# EAGLE design MiMo-Button-V2.0 (EAGLE 8.7.0)
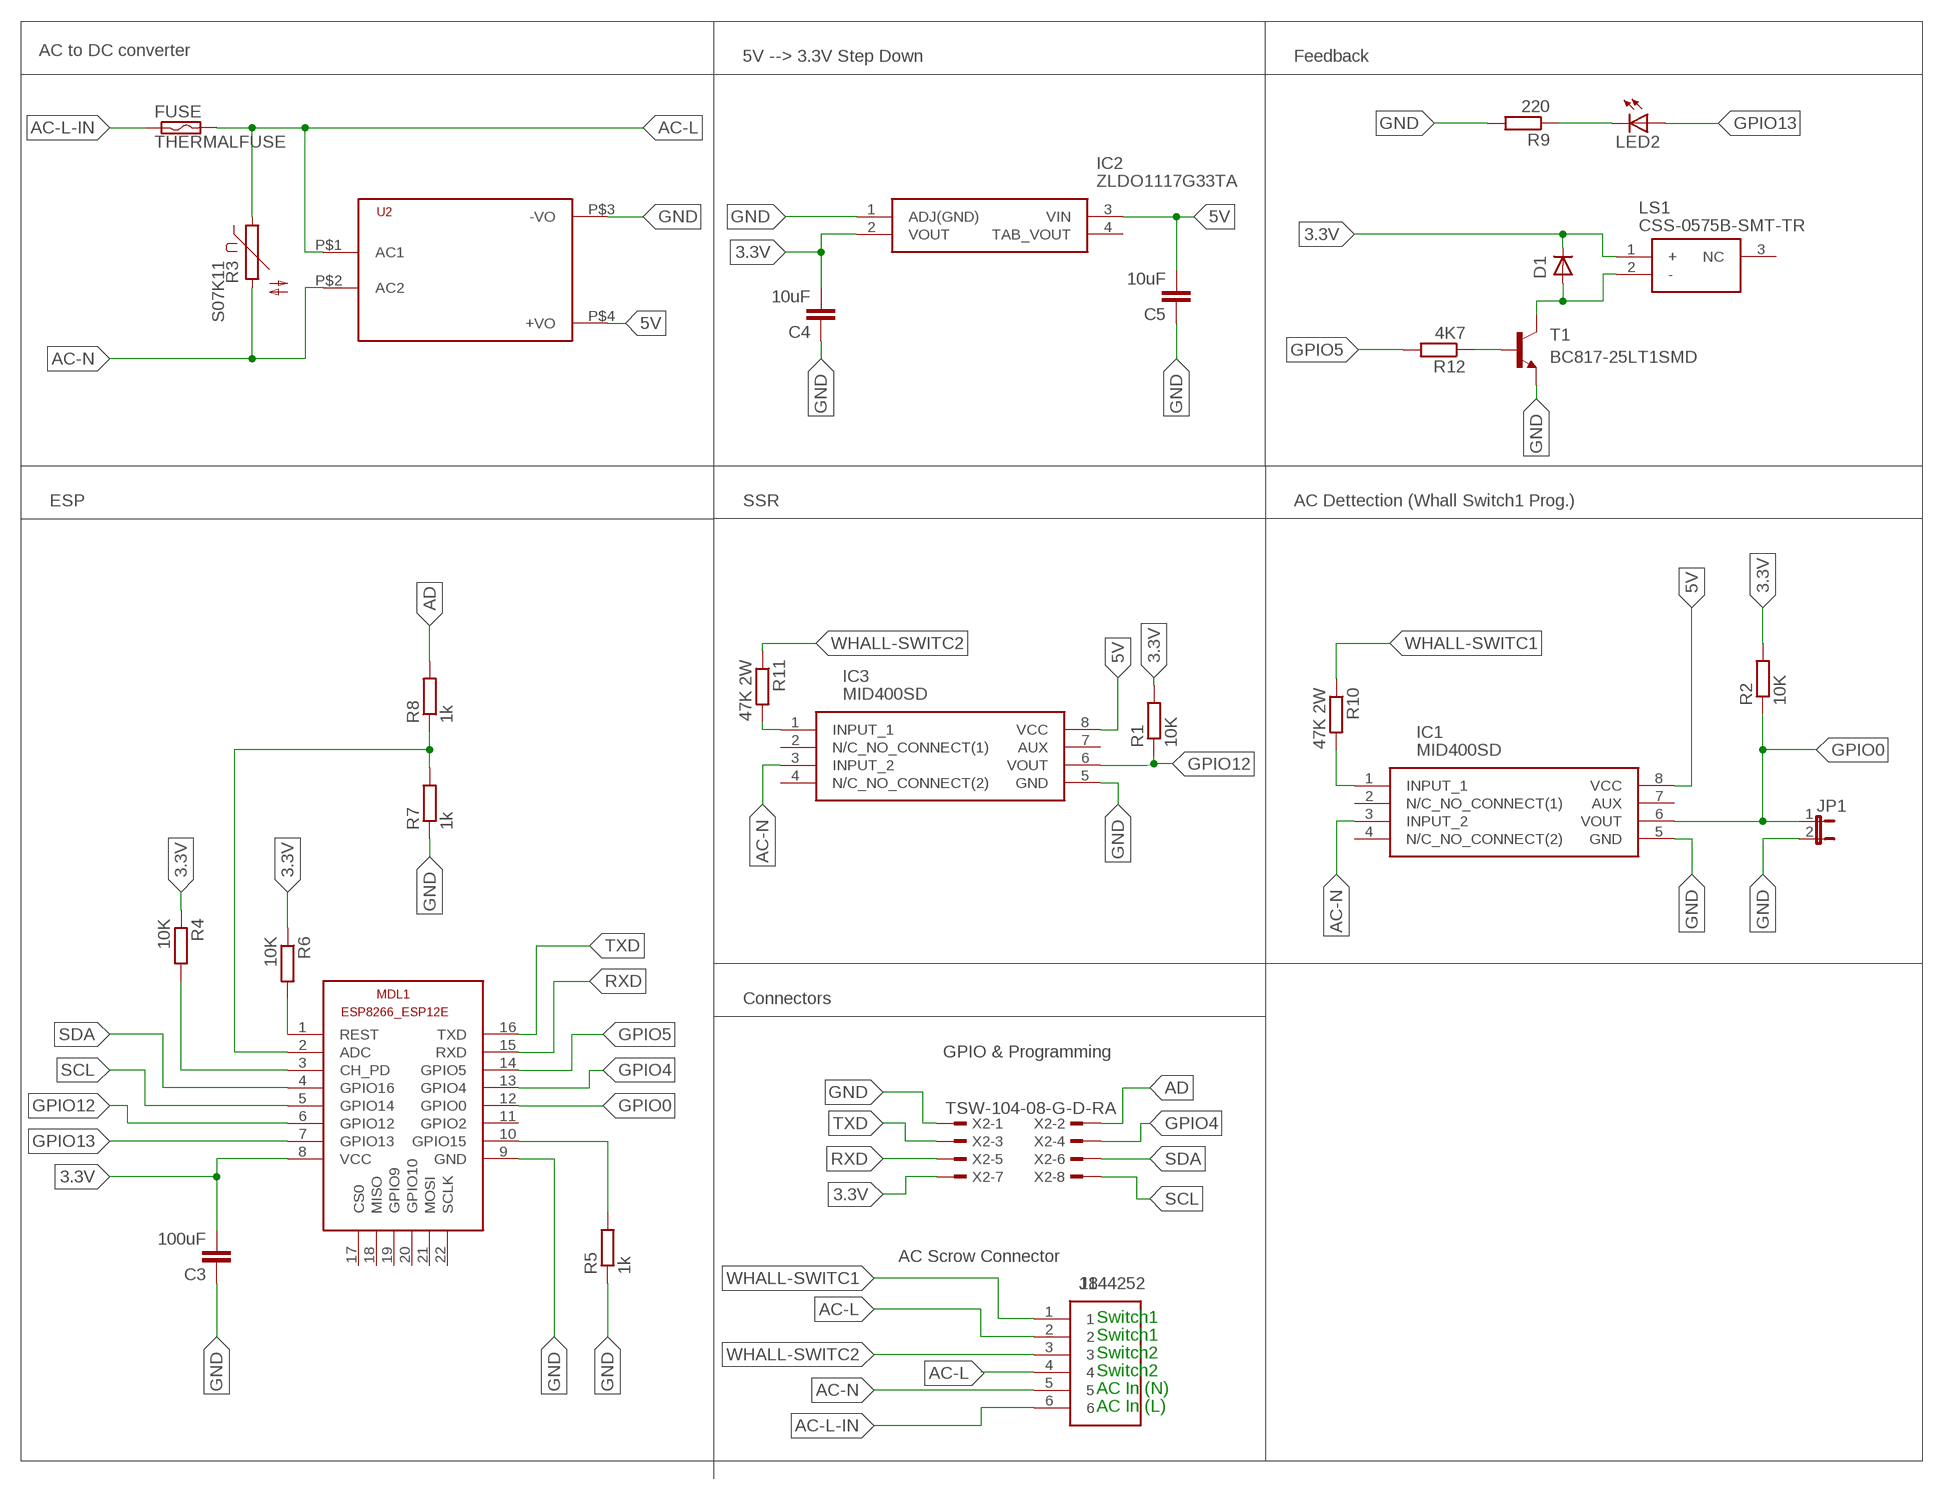
[diagram p0: schematic, sheet 1]

## Parts
C3  100uF  CAP1210  [1210]
C4  10uF  CAP1206  [1206]
C5  10uF  CAP1206  [1206]
D1  DIODE-MINIMELF  [MINIMELF]
FUSE  THERMALFUSE  THERMALFUSE12MM  [TE5]
IC1  MID400SD  [SOP254P1030X508-8N]
IC2  ZLDO1117G33TA  [SOT230P700X180-4N]
IC3  MID400SD  [SOP254P1030X508-8N]
J1  1844252  [SHDR6W100P0X350_1X6_2240X920X7]
JP1  JP1E  [JP1]
LED2  LEDCHIPLED_1206  [CHIPLED_1206]
LS1  CSS-0575B-SMT-TR  [CSS-0575B-SMT-TR]
MDL1  ESP8266-12EESP8266-ESP12E  [ESP8266-ESP12E]
R1  10K  RR1206  [R1206]
R2  10K  RR1206  [R1206]
R3  S07K11  [S07K11]
R4  10K  RR1206  [R1206]
R5  1k  RR1206  [R1206]
R6  10K  RR1206  [R1206]
R7  1k  RR1206  [R1206]
R8  1k  RR1206  [R1206]
R9  220  RR1206  [R1206]
R10  47K 2W  RR2512  [R2512]
R11  47K 2W  RR2512  [R2512]
R12  4K7  RR1206  [R1206]
T1  BC817-25LT1SMD  [SOT23-BEC]
U2  HLK-PM013W  [HLK-PM01]
X2  TSW-104-08-G-D-RA  [TSW-104-08-G-D-RA]

## Nets
3.3V: C3.2 C4.2 D1.C IC2.2(VOUT) LS1.1(+) MDL1.8(VCC) R1.2 R2.2 R4.1 R6.1 X2.7
5V: C5.2 IC1.8(VCC) IC2.3(VIN) IC3.8(VCC) U2.P$4(+VO)
AC-DETECT [AC-detect]: IC1.1(INPUT_1) R10.2
AC-DETECT1 [AC-detect]: IC3.1(INPUT_1) R11.2
AC-L [AC-detect]: FUSE.2 J1.2 J1.4 R3.1 U2.P$1(AC1)
AC-L-IN [AC-detect]: FUSE.1 J1.6
AC-N [AC-detect]: IC1.3(INPUT_2) IC3.3(INPUT_2) J1.5 R3.2 U2.P$2(AC2)
AD: R8.2 X2.2
ADC: MDL1.2(ADC) R7.2 R8.1
GND: C3.1 C4.1 C5.1 IC1.5(GND) IC2.1(ADJ(GND)) IC3.5(GND) JP1.2 MDL1.9(GND) R5.1 R7.1 R9.2 T1.E U2.P$3(-VO) X2.1
GPIO0: IC1.6(VOUT) JP1.1 MDL1.12(GPIO0) R2.1
GPIO4: MDL1.13(GPIO4) X2.4
GPIO5: MDL1.14(GPIO5) R12.2
GPIO12: IC3.6(VOUT) MDL1.6(GPIO12) R1.1
GPIO13: LED2.A MDL1.7(GPIO13)
N$2: LED2.C R9.1
N$5: D1.A LS1.2(-) T1.C
N$6: MDL1.3(CH_PD) R4.2
N$7: R12.1 T1.B
N$8: MDL1.10(GPIO15) R5.2
N$11: MDL1.1(REST) R6.2
RXD: MDL1.15(RXD) X2.5
SCL: MDL1.5(GPIO14) X2.8
SDA: MDL1.4(GPIO16) X2.6
TXD: MDL1.16(TXD) X2.3
WHALL-SWITC1 [AC-detect]: J1.1 R10.1
WHALL-SWITC2 [AC-detect]: J1.3 R11.1
Unconnected: IC1.2(N/C_NO_CONNECT(1)) IC1.4(N/C_NO_CONNECT(2)) IC1.7(AUX) IC2.4(TAB_VOUT) IC3.2(N/C_NO_CONNECT(1)) IC3.4(N/C_NO_CONNECT(2)) IC3.7(AUX) LS1.3(NC) MDL1.11(GPIO2) MDL1.17(CS0) MDL1.18(MISO) MDL1.19(GPIO9) MDL1.20(GPIO10) MDL1.21(MOSI) MDL1.22(SCLK)

## Notes on the sheet
- AC to DC converter
- 5V --> 3.3V Step Down | Feedback
- ESP | SSR | AC Dettection (Whall Switch1 Prog.)
- Connectors
- GPIO & Programming
- AC Scrow Connector
- Switch1
- Switch1
- Switch2
- Switch2
- AC In (N)
- AC In (L)

## Library data of the parts
C3-C5 = SparkFun-Capacitors:CAP: Capacitor Standard 0603 ceramic capacitor, and 0.1" leaded capacitor.
D1 = diode:DIODE-: DIODE
FUSE = Marco-Lib:THERMALFUSE
IC1 IC3 = SamacSys_Parts:MID400SD: Logic Output Optocouplers 8-Pin Optocoupler Logic aC Line Source: Datasheet <https://componentsearchengine.com/Datasheets/1/MID400SD.pdf>; DESCRIPTION: Logic Output Optocouplers 8-Pin Optocoupler Logic aC Line; HEIGHT: 5.08mm; MANUFACTURER_NAME: Fairchild Semiconductor; MANUFACTURER_PART_NUMBER: MID400SD; RS_PART_NUMBER: 8064169P; RS_PRICE/STOCK: http://uk.rs-online.com/web/p/products/8064169P
IC2 = SamacSys_Parts:ZLDO1117G33TA: LDO Regulator Pos 3.3V 1A 4Pin SOT223 Diodes Inc ZLDO1117G33TA, Single Linear Voltage Regulator, 1A 3.3 V, 2%, 3-Pin SOT-223 Source: Datasheet <http://uk.rs-online.com/web/p/products/7515183P>; ALLIED_NUMBER: 70438621; DESCRIPTION: LDO Regulator Pos 3.3V 1A 4Pin SOT223 Diodes Inc ZLDO1117G33TA, Single Linear Voltage Regulator, 1A 3.3 V, 2%, 3-Pin SOT-223; HEIGHT: 1.8mm; MANUFACTURER_NAME: Diodes Inc.; MANUFACTURER_PART_NUMBER: ZLDO1117G33TA; RS_PART_NUMBER: 7515183P
J1 = SamacSys_Parts:1844252: Mini PCB header, R/A, 3.5mm pitch, 6 way Source: Datasheet <http://uk.rs-online.com/web/p/products/8042257>; DESCRIPTION: Mini PCB header, R/A, 3.5mm pitch, 6 way; HEIGHT: 7.25mm; MANUFACTURER_NAME: Phoenix Contact; MANUFACTURER_PART_NUMBER: 1844252; RS_PART_NUMBER: 8042257
JP1 = jumper:JP1E: JUMPER
LED2 = led:LED: LED OSRAM: - CHIPLED LG R971, LG N971, LY N971, LG Q971, LY Q971, LO R971, LY R971 LH N974, LH R974 LS Q976, LO Q976, LY Q976 LO Q996 - Hyper CHIPLED LW Q18S LB Q993, LB Q99A, LB R99A - SideLED LS A670, LO A670, LY A670, LG A670, LP A670 LB A673, LV A673, LT A673, LW A673 LH A674 LY A675 LS A676, LA A676, LO A676, LY A676, LW A676 LS A679, LY A679, LG A679 - Hyper Micro SIDELED® LS Y876, LA Y876, LO Y876, LY Y876 LT Y87S - SmartLED LW L88C, LW L88S LB L89C, LB L89S, LG L890 LS L89K, LO L89K, LY L89K LS L896, LA L896, LO L896, LY L896 - TOPLED LS T670, LO T670, LY T670, LG T670, LP T670 LSG T670, LSP T670, LSY T670, LOP T670, LYG T670 LG T671, LOG T671, LSG T671 LB T673, LV T673, LT T673, LW T673 LH T674 LS T676, LA T676, LO T676, LY T676, LB T676, LH T676, LSB T676, LW T676 LB T67C, LV T67C, LT T67C, LS T67K, LO T67K, LY T67K, LW E67C LS E67B, LA E67B, LO E67B, LY E67B, LB E67C, LV E67C, LT E67C LW T67C LS T679, LY T679, LG T679 LS T770, LO T770, LY T770, LG T770, LP T770 LB T773, LV T773, LT T773, LW T773 LH T774 LS E675, LA E675, LY E675, LS T675 LS T776, LA T776, LO T776, LY T776, LB T776 LHGB T686 LT T68C, LB T68C - Hyper Mini TOPLED® LB M676 - Mini TOPLED Santana® LG M470 LS M47K, LO M47K, LY M47K Source: http://www.osram.convergy.de LUXEON: - LUMILED® LXK2-PW12-R00, LXK2-PW12-S00, LXK2-PW14-U00, LXK2-PW14-V00 LXK2-PM12-R00, LXK2-PM12-S00, LXK2-PM14-U00 LXK2-PE12-Q00, LXK2-PE12-R00, LXK2-PE12-S00, LXK2-PE14-T00, LXK2-PE14-U00 LXK2-PB12-K00, LXK2-PB12-L00, LXK2-PB12-M00, LXK2-PB14-N00, LXK2-PB14-P00, LXK2-PB14-Q00 LXK2-PR12-L00, LXK2-PR12-M00, LXK2-PR14-Q00, LXK2-PR14-R00 LXK2-PD12-Q00, LXK2-PD12-R00, LXK2-PD12-S00 LXK2-PH12-R00, LXK2-PH12-S00 LXK2-PL12-P00, LXK2-PL12-Q00, LXK2-PL12-R00 Source: www.luxeon.com KINGBRIGHT: KA-3528ASYC Source: www.kingbright.com
LS1 = SamacSys_Parts:CSS-0575B-SMT-TR: Speakers & Transducers buzzer, 5 mm square, 2.5 mm deep, M, 4 kHz, 3 V, SMT, no driving circuit Source: Datasheet <http://www.cui.com/product/resource/css-0575b-smt.pdf>; DESCRIPTION: Speakers & Transducers buzzer, 5 mm square, 2.5 mm deep, M, 4 kHz, 3 V, SMT, no driving circuit; HEIGHT: mm; MANUFACTURER_NAME: CUI; MANUFACTURER_PART_NUMBER: CSS-0575B-SMT-TR
MDL1 = ESP8266-ESP12E:ESP8266-12E: ESP8266-12E with additional I/O and GPIO04/05 corrected The author cannot warrant that this library is free from error or will meet your specific requirements. Created by PuceBaboon.com. Komagane, Nagano, JAPAN
R1 R2 R4-R12 = eagle-ltspice:R: RESISTOR, European symbol; SPICEMODEL: NONE; SPICEPREFIX: R
R3 = varistor:S07K11: VARISTOR
T1 = transistor-npn:BC817*: NPN Transistor
U2 = HLK-PM01:HLK-PM01: Hi-Link Power Supply HLK-PM01 3W Author: Ahmed Said <https://github.com/AhmedSaid/EAGLELibraries>
X2 = con-samtec:TSW-104-*-G: THROUGH-HOLE .025" SQ POST HEADER Source: Samtec TSW.pdf; MF: Samtec Inc.; MPN: TSW-104-08-G-D-RA

## Net classes
1 AC: width 1.524 mm, clearance 0.762 mm
2 AC-detect: width 0.762 mm, clearance 1.016 mm

## Board
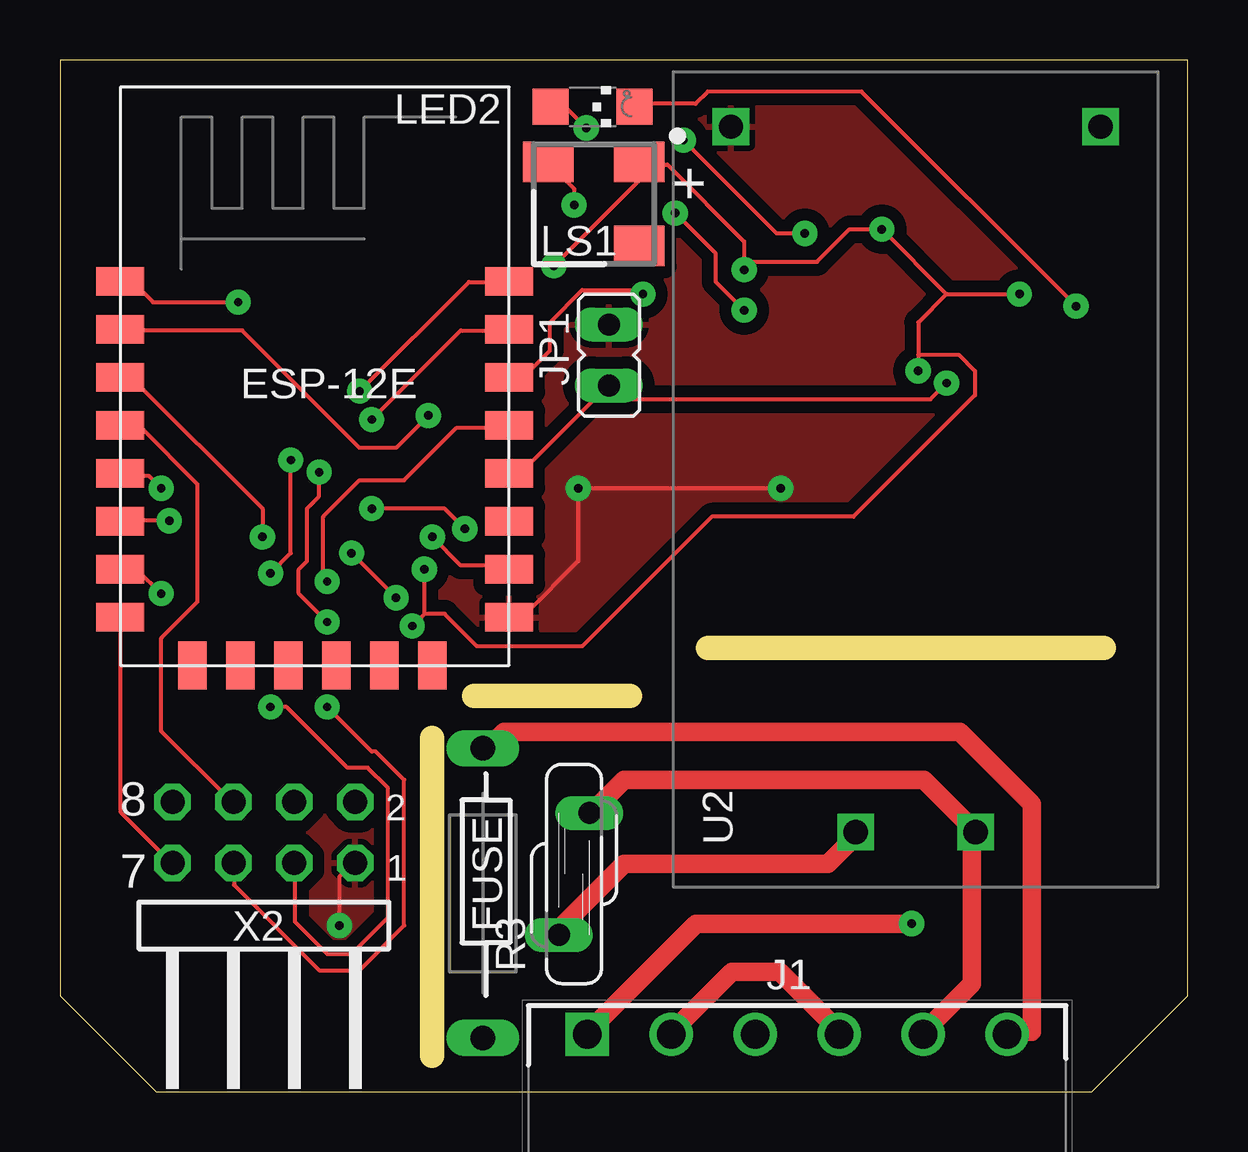
[diagram p1: board, top side]
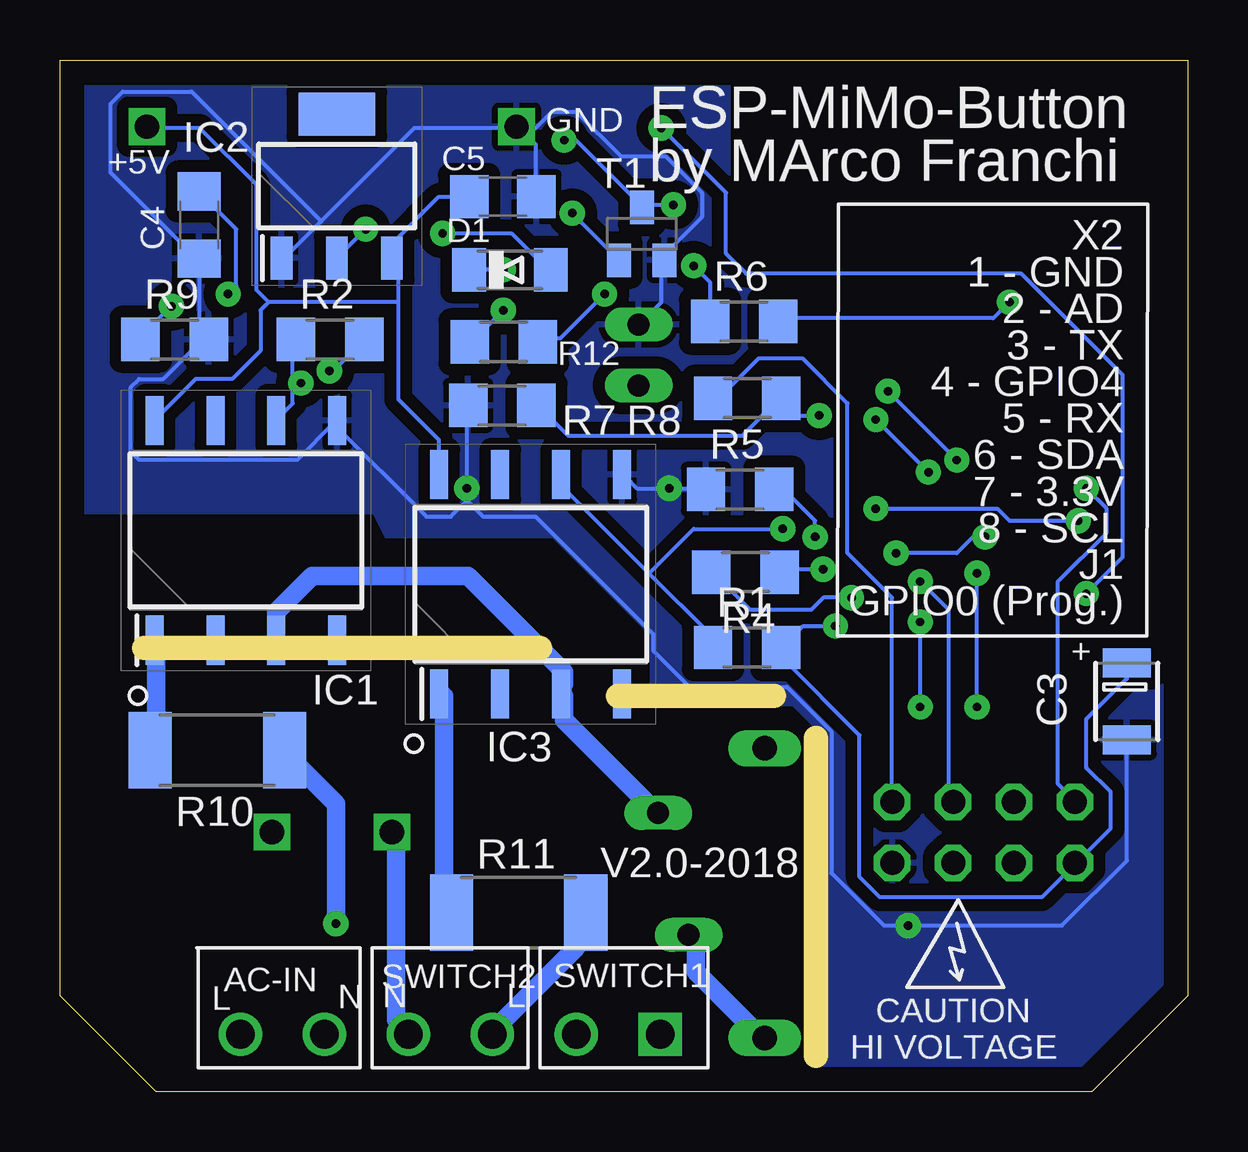
[diagram p2: board, bottom side, seen from below]

Size 47 x 43 mm. Coordinates in mm from the lower left corner, seen from the top.
Outline: 4,0 43,0 47,4 47,43 0,43 0,4 4,0
Copper layers (1*16): Top 0.035mm / dielectric 1.5mm / Bottom 0.035mm
Design rules "default *": minimum track width 0.175mm, minimum drill 0.35mm, track to track 0.5mm, track to pad 0.5mm, pad to pad 6mil, via to via 6mil, smd to smd 6mil, copper to edge 40mil, drill to drill 6mil, minimum pad ring 10mil, minimum via ring 0.35mm, stop-mask expansion 4mil, vias tented up to drill 0mil, thermal gap 10mil
tRestrict: area 15.5,0 to 47,23.5
bRestrict: area 15.5,0 to 47,24
Milling: 3 lines

### Footprints (pad centres in the part's own frame; a part is rotated, then mirrored left to right if it is on the bottom)
1210 = smd 1.2 x 2: 1 -1.6,0; 2 1.6,0
1206 = smd 1.6 x 1.8: 1 -1.4,0; 2 1.4,0
MINIMELF = smd 1.4 x 1.8: A 1.7,0; C -1.7,0
TE5 = drill 1.016 long: 1 -6.04,0; 2 6.04,0
SOP254P1030X508-8N = smd 2.05 x 0.75: 1 -4.575,3.81; 2 -4.575,1.27; 3 -4.575,-1.27; 4 -4.575,-3.81; 5 4.575,-3.81; 6 4.575,-1.27; 7 4.575,1.27; 8 4.575,3.81
SOT230P700X180-4N = smd 1.8 x 0.9: 1 -3,2.3; 2 -3,0; 3 -3,-2.3 | smd 1.8 x 3.2: 4 3,0
SHDR6W100P0X350_1X6_2240X920X7 = drill 1.2 pad 1.8 square: 1 0,0 | drill 1.2 pad 1.8: 2 3.5,0; 3 7,0; 4 10.5,0; 5 14,0; 6 17.5,0
JP1 = drill 0.914 long: 1 0,-1.27; 2 0,1.27
CHIPLED_1206 = smd 1.5 x 1.5: A 0,-1.75; C 0,1.75
CSS-0575B-SMT-TR = smd 2.1 x 1.7: 1 -1.9,-1.75; 2 1.9,-1.75; 3 -1.9,1.75
ESP8266-ESP12E = smd 2 x 1.2: 1 -7.62,5.84; 2 -7.62,3.84; 3 -7.62,1.84; 4 -7.62,-0.16; 5 -7.62,-2.16; 6 -7.62,-4.16; 7 -7.62,-6.16; 8 -7.62,-8.16; 9 8.58,-8.16; 10 8.58,-6.16; 11 8.58,-4.16; 12 8.58,-2.16; 13 8.58,-0.16; 14 8.58,1.84; 15 8.58,3.84; 16 8.58,5.84 | smd 1.2 x 2: 17 -4.62,-10.16; 18 -2.62,-10.16; 19 -0.62,-10.16; 20 1.38,-10.16; 21 3.38,-10.16; 22 5.38,-10.16
R1206 = smd 1.6 x 1.803: 1 -1.422,0; 2 1.422,0
S07K11 = drill 0.914 long: 1 -0.635,-2.54; 2 0.635,2.54
R2512 = smd 1.8 x 3.2: 1 -2.8,0; 2 2.8,0
SOT23-BEC = smd 1 x 1.4: B -0.95,-1.1; C 0,1.1; E 0.95,-1.1
HLK-PM01 = drill 1.016 square: P$1 -14.7,2.5; P$2 -14.7,-2.5; P$3 14.7,7.7; P$4 14.7,-7.7
TSW-104-08-G-D-RA = drill 1 pad 1.5 octagon: 1 3.81,1.524; 2 3.81,4.064; 3 1.27,1.524; 4 1.27,4.064; 5 -1.27,1.524; 6 -1.27,4.064; 7 -3.81,1.524; 8 -3.81,4.064

### Placement (x,y rotation side)
C3  2.53,16.26 90 bottom
C4  41.2,36.12 90 bottom
C5  28.54,37.3 180 bottom
D1  28.25,34.25 0 bottom
FUSE  17.63,8.27 270 top
IC1  39.25,23.39 90 bottom
IC2  35.46,37.74 90 bottom
IC3  27.38,21.14 90 bottom
J1  21.98,2.38 0 top
JP1  22.88,30.7 0 top
LED2  22.2,41.05 270 top
LS1  22.25,37 180 top
MDL1  10.14,27.93 0 top
R1  18.36,18.51 0 bottom
R2  35.74,31.35 0 bottom
R3  21.43,9.07 0 top
R4  18.43,21.65 180 bottom
R5  18.65,25.1 0 bottom
R6  18.48,32.1 0 bottom
R7  28.56,28.6 0 bottom
R8  18.36,28.9 180 bottom
R9  42.22,31.35 0 bottom
R10  40.44,14.23 180 bottom
R11  27.88,7.46 180 bottom
R12  28.5,31.25 0 bottom
T1  22.75,35.75 0 bottom
U2  35.67,25.52 90 top
X2  8.5,8 0 top

### Tracks (layer width: path | path; a pad name or v marks a point on that pad's centre or on a via)
3.3V  (via drill 0.35)
  Top 0.175: 15.19,19.91 v15.19,21.77 | v14.68,19.41 15.19,19.91 | MDL1.8 2.53,19.74 2.53,11.64 4.56,9.62 X2.7 | 28.52,34.59 28.52,35.44 25.31,38.64 24.3,38.64 LS1.1 24.13,38.64 24.13,37.97 v20.59,34.42 | 28.52,34.59 31.56,34.59 32.91,35.94 v34.26,35.94 36.96,33.24 | 28.52,34.59 v28.52,34.26 | 36.96,33.24 v39.99,33.24 | 35.77,30.71 35.77,32.06 36.96,33.24 | 35.77,30.71 v35.77,30.04 | 15.19,19.91 16.03,19.91 17.38,18.56 21.77,18.56 27.17,23.96 33.08,23.96 38.14,29.02 38.14,30.04 37.46,30.71 35.77,30.71
  Bottom 0.175: v15.19,21.77 16.88,21.77 R4.1 | v14.68,19.41 16.03,19.41 16.88,18.56 R1.2 16.88,18.39 16.88,18.06 13.67,14.85 13.67,8.94 12.82,8.1 6.08,8.1 4.72,9.45 X2.7 4.56,9.62 3.21,10.97 3.21,12.49 4.22,13.5 4.22,15.53 2.53,17.21 2.53,17.72 C3.2 | v28.52,34.26 29.87,34.26 D1.C | v34.26,35.94 IC2.2 | v39.99,33.24 39.66,33.58 39.66,35.94 41.17,37.46 C4.2 | v35.77,30.04 35.61,30.04 34.42,31.22 R2.2 | v20.59,34.42 19.91,33.75 19.91,32.23 R6.1
5V
  Bottom 0.175: C5.2 30.04,37.29 31.22,37.29 33.08,35.44 33.08,34.76 IC2.3 33.08,34.59 32.91,34.42 32.91,32.91 | 32.91,32.91 32.91,28.86 31.22,27.17 31.22,25.82 IC3.8 | 38.31,32.91 38.64,32.57 38.64,30.88 39.83,29.7 41.34,29.7 43.03,28.01 IC1.8 | 32.91,32.91 38.31,32.91 | 38.31,32.91 38.81,33.41 38.81,37.8 41.17,40.16 43.37,40.16 U2.P$4
AC-DETECT
  Bottom 0.762: IC1.1 43,18.5 43,14.5 R10.2
AC-DETECT1
  Bottom 0.762: IC3.1 31,16.5 31,7.5 R11.2
AC-L
  Top 0.762: J1.2 25.5,2.5 28,5 30,5 32.5,2.5 J1.4 | R3.1 21,7 23.5,9.5 32,9.5 33,10.5 U2.P$1
  Bottom 0.762: R3.1 20.5,6.5 20.5,5 18,2.5 FUSE.2 | U2.P$1 33,10.5 33,3 32.5,2.5 J1.4
AC-L-IN
  Top 0.762: FUSE.1 18,14.5 18.5,15 37.5,15 40.5,12 40.5,2.5 39.5,2.5 J1.6
AC-N
  Top 0.762: J1.5 36,2.5 38,4.5 38,10.5 U2.P$2 38,11 36,13 23.5,13 22.5,12 R3.2
  Bottom 0.762: R3.2 22.5,12 26,15.5 26,16.5 IC3.3 26,17 26,17.5 30,21.5 36.5,21.5 38,20 38,19 IC1.3
AD
  Bottom 0.175: R8.2 19.74,29.02 19.41,29.02 17.89,30.54 16.03,30.54 14.18,28.69 14.18,22.44 12.32,20.59 12.32,12.15 X2.2
ADC  (via drill 0.35)
  Top 0.175: v15.36,28.18 14.01,26.83 12.49,26.83 7.59,31.73 2.53,31.73 MDL1.2
  Bottom 0.175: R7.2 27,28.52 25.82,27.34 18.56,27.34 17.04,28.86 R8.1 16.88,28.86 16.2,28.18 v15.36,28.18
GND  (via drill 0.35)
  Top 0.175: v11.64,6.92 11.64,8.94 12.15,9.45 X2.1 | MDL1.9 18.73,19.91 19.41,19.91 21.6,22.11 v21.6,25.14 v30.04,25.14
  Bottom 0.175: JP1.2 22.78,32.06 21.94,32.91 21.94,34.59 T1.E 21.77,34.76 21.77,34.93 20.25,36.45 20.25,37.46 21.77,38.98 23.62,38.98 25.48,40.84 26.49,40.84 27.51,39.83 | 27.51,39.83 27.84,40.16 U2.P$3 | 27.51,39.83 27.17,39.49 27.17,37.46 C5.1 | 36.11,36.28 32.23,40.16 28.01,40.16 U2.P$3 | 36.11,36.28 37.63,34.76 IC2.1 | 27.51,39.83 U2.P$3 | C3.1 2.53,14.51 2.53,9.62 5.23,6.92 v11.64,6.92 12.66,6.92 14.85,9.11 14.85,15.02 16.71,16.88 20.76,16.88 22.27,18.39 22.27,19.07 27.17,23.96 29.36,23.96 30.04,24.64 | R5.1 20.08,25.14 v21.6,25.14 22.95,25.14 23.46,25.65 IC3.5 | 30.04,24.64 30.71,23.96 31.73,23.96 35.61,27.84 | R7.1 30.04,28.52 v30.04,25.14 30.04,24.64 | 35.61,27.84 37.12,26.32 43.71,26.32 44.04,26.66 44.04,29.36 43.71,29.7 42.69,29.7 41.17,31.22 40.84,31.22 R9.2 40.84,31.39 41.17,31.73 41.17,34.59 C4.1 41.34,34.76 44.89,38.31 44.89,41.17 44.38,41.68 41.51,41.68 36.11,36.28 | 35.61,27.84 IC1.5
  pour Top: 0,43 47,43 47,4 43,0 4,0 0,4
  pour Bottom: 0,43 47,43 47,4 43,0 4,0 0,4
GPIO0  (via drill 0.35)
  Top 0.175: MDL1.12 18.73,25.82 19.24,25.82 22.78,29.36 JP1.1 22.95,29.36 23.46,28.86 36.28,28.86 v36.96,29.53
  Bottom 0.175: 37.29,29.53 37.29,28.69 37.97,28.01 IC1.6 | 37.29,29.53 37.29,31.22 R2.1 | v36.96,29.53 37.29,29.53
GPIO4  (via drill 0.35)
  Top 0.175: v11.14,21.26 10.97,21.43 10.97,23.96 12.49,25.48 14.34,25.48 16.54,27.68 18.56,27.68 MDL1.13
  Bottom 0.175: v11.14,21.26 9.96,20.08 9.96,12.32 9.79,12.15 X2.4
GPIO5  (via drill 0.35)
  Top 0.175: v24.3,33.24 24.13,33.41 21.77,33.41 20.42,32.06 20.42,30.88 19.41,29.87 18.73,29.87 MDL1.14
  Bottom 0.175: v24.3,33.24 26.16,31.39 27,31.39 R12.2
GPIO12  (via drill 0.35)
  Top 0.175: v4.56,23.79 2.53,23.79 MDL1.6 | v12.99,24.3 16.03,24.3 v16.88,23.46
  Bottom 0.175: 22.44,21.6 25.99,25.14 25.99,25.65 IC3.6 | 22.44,21.6 19.91,19.07 19.91,18.56 R1.1 | v4.56,23.79 7.42,23.79 7.93,24.3 v12.99,24.3 | v16.88,23.46 20.59,23.46 22.44,21.6
GPIO13  (via drill 0.35)
  Top 0.175: v21.94,40.16 21.09,41.01 20.59,41.01 LED2.A | v4.22,20.76 3.21,21.77 2.53,21.77 MDL1.7
  Bottom 0.175: v21.94,40.16 19.24,37.46 19.24,34.93 18.39,34.09 6.92,34.09 2.7,29.87 2.7,22.27 v4.22,20.76
N$2  (via drill 0.35)
  Top 0.175: v42.36,32.74 33.41,41.68 27,41.68 26.49,41.17 23.96,41.17 LED2.C
  Bottom 0.175: v42.36,32.74 43.71,31.39 R9.1
N$5  (via drill 0.35)
  Top 0.175: v21.43,36.96 21.43,37.63 20.42,38.64 LS1.2 | v31.05,35.77 29.87,35.77 v25.99,39.66
  Bottom 0.175: v21.43,36.96 22.61,36.96 T1.C 22.78,36.96 25.48,39.66 v25.99,39.66 | v31.05,35.77 28.18,35.77 26.66,34.26 D1.A
N$6  (via drill 0.35)
  Top 0.175: v12.15,22.44 v14.01,20.59 | v8.44,23.12 8.44,24.3 3.04,29.7 2.53,29.7 MDL1.3
  Bottom 0.175: v14.01,20.59 15.19,20.59 15.69,20.08 18.23,20.08 19.74,21.6 R4.2 | v12.15,22.44 9.62,22.44 8.94,23.12 v8.44,23.12
N$7  (via drill 0.35)
  Top 0.175: v25.65,36.62 27.34,34.93 27.34,33.75 v28.52,32.57
  Bottom 0.175: v25.65,36.62 23.79,34.76 T1.B | v28.52,32.57 29.87,31.22 R12.1
N$8  (via drill 0.35)
  Top 0.175: v15.53,23.12 16.71,21.94 18.56,21.94 MDL1.10
  Bottom 0.175: v15.53,23.12 15.53,23.79 16.71,24.98 17.21,24.98 R5.2
N$11  (via drill 0.35)
  Top 0.175: v7.42,32.91 3.88,32.91 3.04,33.75 2.53,33.75 MDL1.1
  Bottom 0.175: v7.42,32.91 8.1,32.23 17.04,32.23 R6.2
RXD  (via drill 0.35)
  Top 0.175: v12.99,28.01 16.71,31.73 18.56,31.73 MDL1.15 | v10.8,25.82 10.8,24.81 10.29,24.3 10.29,22.11 9.96,21.77 9.96,20.76 v11.14,19.57 | v11.14,16.03 12.99,14.18 13.16,14.18 14.34,12.99 14.34,6.92 12.49,5.06 10.8,5.06 7.26,8.61 7.26,9.45 X2.5
  Bottom 0.175: v10.8,25.82 v12.99,28.01 | v11.14,16.03 v11.14,19.57
SCL  (via drill 0.35)
  Top 0.175: v4.22,25.14 3.71,25.65 2.53,25.65 MDL1.5
  Bottom 0.175: v4.22,25.14 3.38,24.3 3.38,23.29 5.4,21.26 5.4,12.82 4.72,12.15 X2.8
SDA
  Top 0.175: MDL1.4 2.53,27.68 3.38,27.68 5.74,25.31 5.74,20.42 4.22,18.9 4.22,15.02 7.09,12.15 X2.6
TXD  (via drill 0.35)
  Top 0.175: v12.49,29.19 17.04,33.75 18.56,33.75 MDL1.16 | v9.62,26.32 9.62,22.44 v8.78,21.6 | v8.78,16.03 9.45,16.03 11.98,13.5 12.82,13.5 13.67,12.66 13.67,7.26 12.15,5.74 11.14,5.74 9.79,7.09 9.79,9.45 X2.3
  Bottom 0.175: v9.62,26.32 v12.49,29.19 | v8.78,16.03 v8.78,21.6
WHALL-SWITC1  (via drill 0.35)
  Top 0.762: v35.5,7 26.5,7 22,2.5 J1.1
  Bottom 0.762: v35.5,7 35.5,12 37.5,14 R10.1
WHALL-SWITC2
  Bottom 0.762: R11.1 25.5,7 25.5,6 29,2.5 J1.3

### Text on the board
tNames: + | 8 | 7
bNames: GND | ESP-MiMo-Button / by MArco Franchi | +5V | X2 / 1 - GND / 2 - AD / 3 - TX / 4 - GPIO4 / 5 - RX / 6 - SDA / 7 - 3.3V / 8 - SCL / J1 / GPIO0 (Prog.) | + | V2.0-2018 | SWITCH1 | L | N | SWITCH2 | AC-IN | N | L | CAUTION / HI VOLTAGE